# Altium schematic sheet Microcontroller_CC1350.SchDoc
size 508 x 279 mm
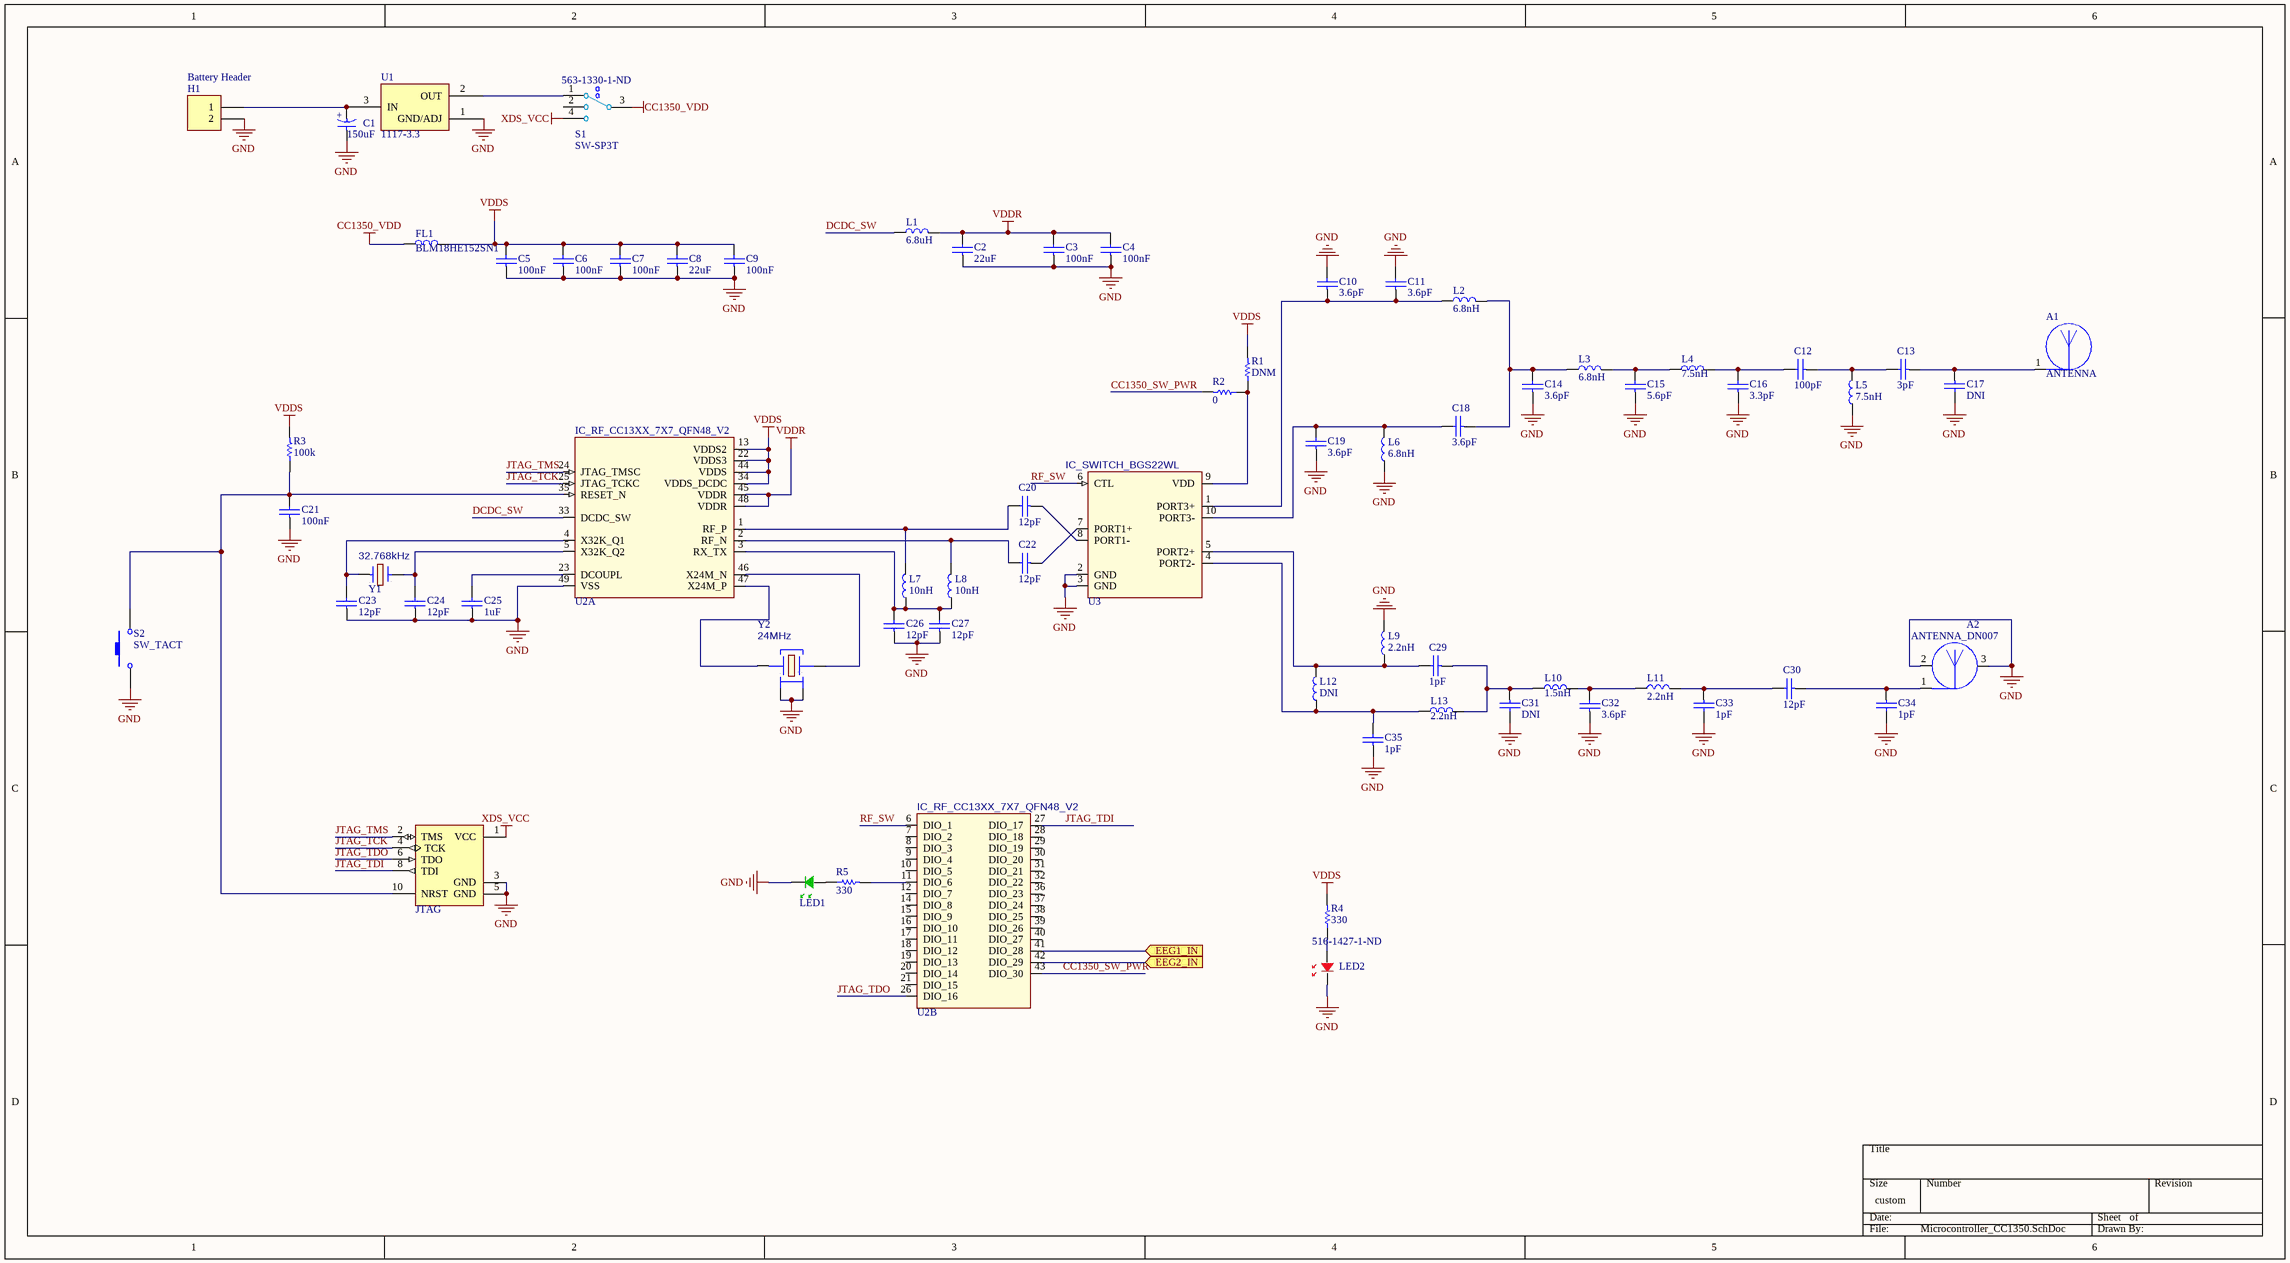
[diagram p0: Microcontroller_CC1350.SchDoc]

## Parts
A1  ANTENNA  [Sub-1GHz-Antenna]
A2  ANTENNA_DN007  [Inverted_F_Antenna]
C1  150uF  [2312 [IMP] Polar]
C2  22uF  [0603[IMP]]
C3  100nF  [0402[IMP]]
C4  100nF  [0402[IMP]]
C5  100nF  [0402[IMP]]
C6  100nF  [0402[IMP]]
C7  100nF  [0402[IMP]]
C8  22uF  [0603[IMP]]
C9  100nF  [0402[IMP]]
C10  3.6pF  [0402[IMP]]
C11  3.6pF  [0402[IMP]]
C12  100pF  [0402[IMP]]
C13  3pF  [0402[IMP]]
C14  3.6pF  [0402[IMP]]
C15  5.6pF  [0402[IMP]]
C16  3.3pF  [0402[IMP]]
C17  DNI  [0402[IMP]]
C18  3.6pF  [0402[IMP]]
C19  3.6pF  [0402[IMP]]
C20  12pF  [0402[IMP]]
C21  100nF  [0402[IMP]]
C22  12pF  [0402[IMP]]
C23  12pF  [0402[IMP]]
C24  12pF  [0402[IMP]]
C25  1uF  [0402[IMP]]
C26  12pF  [0402[IMP]]
C27  12pF  [0402[IMP]]
C29  1pF  [0402[IMP]]
C30  12pF  [0402[IMP]]
C31  DNI  [0402[IMP]]
C32  3.6pF  [0402[IMP]]
C33  1pF  [0402[IMP]]
C34  1pF  [0402[IMP]]
C35  1pF  [0402[IMP]]
FL1  BLM18HE152SN1  [0603[IMP]]
H1  Battery Header  [S2B-PH-SM4-TB]
H2  JTAG  [HDR-2*5-0.05_Without_Through_Hole]
L1  6.8uH  [0805[IMP]]
L2  6.8nH  [0402[IMP]]
L3  6.8nH  [0402[IMP]]
L4  7.5nH  [0402[IMP]]
L5  7.5nH  [0402[IMP]]
L6  6.8nH  [0402[IMP]]
L7  10nH  [0402[IMP]]
L8  10nH  [0402[IMP]]
L9  2.2nH  [0402[IMP]]
L10  1.5nH  [0402[IMP]]
L11  2.2nH  [0402[IMP]]
L12  DNI  [0402[IMP]]
L13  2.2nH  [0402[IMP]]
LED1  LEDG  [0805[IMP] - POLAR]  (value not drawn)
LED2  Supplier Part Number 1: 516-1427-1-ND  [0805[IMP] - POLAR]  (hidden comment: LEDR)
R1  DNM  [0402[IMP]]
R2  0  [0402[IMP]]
R3  100k  [0402[IMP]]
R4  330  [0402[IMP]]
R5  330  [0402[IMP]]
S1  SW-SP3T  Supplier Part Number 1: 563-1330-1-ND  [CL-SB-13B]
S2  SW_TACT  [PTS645SH50SMTR92_LFS]
U1  1117-3.3  [SOT-223]
U2  IC_RF_CC13XX_7X7_QFN48_V2  [RGZ(S-PVQFN-N48) - duplicate]  (parts A,B of 2)
U3  IC_SWITCH_BGS22WL  [TSLP-10-1]
Y1  32.768kHz  [FC-135]
Y2  24MHz  [TSX-3225]

## Ports
EEG1_IN (in), EEG2_IN (in)

## Nets
CC1350_VDD: FL1.1 S1.3
GND: A2.2(GND_2) A2.3(GND_3) C1.1 C2.2 C3.2 C4.2 C5.2 C6.2 C7.2 C8.2 C9.2 C10.1 C11.1 C14.2 C15.2 C16.2 C17.1 C19.2 C21.2 C23.2 C24.2 C25.2 C26.2 C27.2 C31.1 C32.2 C33.1 C34.1 C35.2 H1.2 H2.3(GND) H2.5(GND) L5.1 L6.1 L9.2 LED1.2(K) LED2.2(K) S2.1 U1.1(GND/ADJ) U2.49(VSS) U3.2(GND) U3.3(GND) Y2.2 Y2.4
VDDR: C2.1 C3.1 C4.1 L1.2 U2.45(VDDR) U2.48(VDDR)
VDDS: C5.1 C6.1 C7.1 C8.1 C9.1 FL1.2 R1.2 R3.2 R4.2 U2.13(VDDS2) U2.22(VDDS3) U2.34(VDDS_DCDC) U2.44(VDDS)
XDS_VCC: H2.1(VCC) S1.4
CC1350_SW_PWR: R2.2 U2.43(DIO_30)
DCDC_SW: L1.1 U2.33(DCDC_SW)
EEG1_IN: U2.41(DIO_28) ; port EEG1_IN
EEG2_IN: U2.42(DIO_29) ; port EEG2_IN
JTAG_TCK: H2.4(TCK) U2.25(JTAG_TCKC)
JTAG_TDI: H2.8(TDI) U2.27(DIO_17)
JTAG_TDO: H2.6(TDO) U2.26(DIO_16)
JTAG_TMS: H2.2(TMS) U2.24(JTAG_TMSC)
RF_SW: U2.6(DIO_1) U3.6(CTL)
NetA1_1: A1.1(FEED/GND_1) C13.2 C17.2
NetA2_1: A2.1(FEED_1) C30.2 C34.2
NetC1_2: C1.2 H1.1 U1.3(IN)
NetC10_2: C10.2 C11.2 L2.1 U3.1(PORT3+)
NetC12_1: C12.1 C16.1 L4.2
NetC12_2: C12.2 C13.1 L5.2
NetC14_1: C14.1 C18.2 L2.2 L3.1
NetC15_1: C15.1 L3.2 L4.1
NetC18_1: C18.1 C19.1 L6.2 U3.10(PORT3-)
NetC20_1: C20.1 L7.2 U2.1(RF_P)
NetC20_2: C20.2 U3.8(PORT1-)
NetC21_1: C21.1 H2.10(NRST) R3.1 S2.2 U2.35(RESET_N)
NetC22_1: C22.1 L8.2 U2.2(RF_N)
NetC22_2: C22.2 U3.7(PORT1+)
NetC23_1: C23.1 U2.4(X32K_Q1) Y1.1
NetC24_1: C24.1 U2.5(X32K_Q2) Y1.2
NetC25_1: C25.1 U2.23(DCOUPL)
NetC26_1: C26.1 C27.1 L7.1 L8.1 U2.3(RX_TX)
NetC29_1: C29.1 L9.1 L12.2 U3.5(PORT2+)
NetC29_2: C29.2 C31.2 L10.1 L13.2
NetC30_1: C30.1 C33.2 L11.2
NetC32_1: C32.1 L10.2 L11.1
NetC35_1: C35.1 L12.1 L13.1 U3.4(PORT2-)
NetLED1_1: LED1.1(A) R5.1
NetLED2_1: LED2.1(A) R4.1
NetR1_1: R1.1 R2.1 U3.9(VDD)
NetR5_2: R5.2 U2.11(DIO_6)
NetS1_1: S1.1 U1.2(OUT)
NetU2_46: U2.46(X24M_N) Y2.3
NetU2_47: U2.47(X24M_P) Y2.1

Not connected (* = marked no-connect by the designer): S1 2; U2 7(DIO_2) 8(DIO_3) 9(DIO_4) 10(DIO_5) 12(DIO_7) 14(DIO_8) 15(DIO_9) 16(DIO_10) 17(DIO_11) 18(DIO_12) 19(DIO_13) 20(DIO_14) 21(DIO_15) 28(DIO_18) 29(DIO_19) 30(DIO_20) 31(DIO_21) 32(DIO_22) 36(DIO_23) 37(DIO_24) 38(DIO_25) 39(DIO_26) 40(DIO_27)

## Notes on the sheet
- (in symbol Cap_E) +

## Library data of the parts
A1 = ANTENNA: Designed by: Pawel Kwaskiewicz; CLASS: DISCRETE; Design date: 2010-02-22
A2 = ANTENNA_DN007: Designed by: Artur Bielinski; Design date: 2011-09-19
C1 = Cap_E: Capacitor; Value: 150uF; Supplier 1: Digi-Key; Supplier Part Number 1: 478-3481-1-ND
C2-C27 C29-C35 = CAPACITOR: VOLTAGE: CMAX; CURRENT: CIMAX; KNEE: CBMAX; PSpiceTemplate: C^@REFDES %1 %2 ?TOLERANCE|C^@REFDES| @VALUE ?IC/IC=@IC/ TC=@TC1,@TC2 ?TOLERANCE|\n.model C^@REFDES CAP C=1 DEV=@TOLERANCE%|; DIST: FLAT; SLOPE: CSMAX; MAX_TEMP: CTMAX; TC1: 0; CLASS: DISCRETE; TC2: 0
  C2 C8: Value: 22uF; Supplier 1: Digi-Key; Supplier Part Number 1: 490-7611-1-ND
  C3-C7 C9 C21: Value: 100nF; Supplier 1: Digi-Key; Supplier Part Number 1: 490-6327-1-ND
  C10 C14 C18 C19 C32: Value: 3.6pF; Supplier 1: Digi-Key; Supplier Part Number 1: 490-5939-1-ND
  C11: Value: 3.6pF; Supplier 1: Digi-Key; Supplier Part Number 1: 399-14982-1-ND; Supplier 2: Digi-Key; Supplier Part Number 2: 490-5939-1-ND
  C12: Value: 100pF; Supplier 1: Digi-Key; Supplier Part Number 1: 490-7753-1-ND
  C13: Value: 3pF; Supplier 1: Digi-Key; Supplier Part Number 1: 712-1282-1-ND
  C15: Value: 5.6pF; Supplier 1: Digi-Key; Supplier Part Number 1: 490-6250-1-ND
  C16: Value: 3.3pF; Supplier 1: Digi-Key; Supplier Part Number 1: 490-5938-1-ND
  C17 C31: Value: DNI
  C20 C22-C24 C26 C27: Value: 12pF; Supplier 1: Digi-Key; Supplier Part Number 1: 399-1013-1-ND
  C25: Value: 1uF; Supplier 1: Digi-Key; Supplier Part Number 1: 1276-1448-1-ND
  C29 C33-C35: Value: 1pF; Supplier 1: Digi-Key; Supplier Part Number 1: 490-3199-1-ND
  C30: Value: 12pF; Supplier 1: Digi-Key; Supplier Part Number 1: 490-5924-1-ND
FL1 L1-L13 = INDUCTOR: Current: LMAX; PSpiceTemplate: L^@REFDES %1 %2 ?TOLERANCE|L^@REFDES| @VALUE ?IC/IC=@IC/ ?TOLERANCE|\n.model l^@REFDES IND L=1 DEV=@TOLERANCE%|; DIELECTRIC: DSMAX; DIST: FLAT
  FL1: Value: BLM18HE152SN1; Supplier 1: Digi-Key; Supplier Part Number 1: 490-5216-1-ND
  L1: Value: 6.8uH; Supplier 1: Digi-Key; Supplier Part Number 1: 445-6761-1-ND
  L2 L6: Value: 6.8nH; Supplier 1: Digi-Key; Supplier Part Number 1: 712-1419-1-ND
  L3: Value: 6.8nH; Supplier 1: Digi-Key; Supplier Part Number 1: 587-1543-1-ND
  L4 L5: Value: 7.5nH; Supplier 1: Digi-Key; Supplier Part Number 1: 490-3456-1-ND
  L7 L8: Value: 10nH; Supplier 1: Digi-Key; Supplier Part Number 1: 712-1407-1-ND
  L9 L11 L13: Value: 2.2nH; Supplier 1: Digi-Key; Supplier Part Number 1: 490-6794-1-ND
  L10: Value: 1.5nH; Supplier 1: Digi-Key; Supplier Part Number 1: 490-6783-1-ND
  L12: Value: DNI
H1 = Header 2: Supplier 1: Digi-Key; Supplier Part Number 1: 455-1749-1-ND
H2 = JTAG-ARM: USB JTAG Programmer; Supplier 1: Digi-Key; Supplier Part Number 1: SAM13160CT-ND
LED1 = LED_G: LED; Value: ?; Supplier 1: Digi-Key; Supplier 2: Digi-Key; Supplier Part Number 2: 475-1410-1-ND
LED2 = LED_R: LED; Value: ?; Supplier 1: Digi-Key
R1-R5 = RESISTOR
  R1: Value: DNM
  R2: Value: 0; Supplier 1: Digi-Key; Supplier Part Number 1: 541-0.0YBCT-ND
  R3: Value: 100k; Supplier 1: Digi-Key; Supplier Part Number 1: 541-100KYACT-ND
  R4 R5: Value: 330; Supplier 1: Digi-Key; Supplier Part Number 1: P330LCT-ND
S2 = SW_TACT: Tactile switch; Supplier 1: Digi-Key; Supplier Part Number 1: CKN9085CT-ND
U1 = 1117-3.3V: 3.3V Voltage Regulator; Supplier 1: Digi-Key; Supplier Part Number 1: LM1117IMPX-3.3/NOPBCT-ND
U2 = IC_RF_CC13XX_7X7_QFN48_V2: Designed_By: Artur Bielinski; SPLIT_INST: TRUE; SWAP_INFO: (S1+S2); Design_Date: 2014-09-04; Supplier 1: Digi-Key; Supplier Part Number 1: 296-44716-1-ND
U3 = IC_SWITCH_XMSSJE3G0PA-00: CLASS: IC; Designed_By: Artur Bielinski; Design_Date: 2015-06-03; Supplier 1: Digi-Key; Supplier Part Number 1: BGS22WL10E6327XTSA1CT-ND
Y1 = CRYSTAL: Supplier 1: Digi-Key; Supplier Part Number 1: SER4089CT-ND
Y2 = XTAL_4PIN_S: Supplier 1: Digi-Key; Supplier Part Number 1: SER3635CT-ND
S1 = SW-SP3T: Supplier 1: Digi-Key